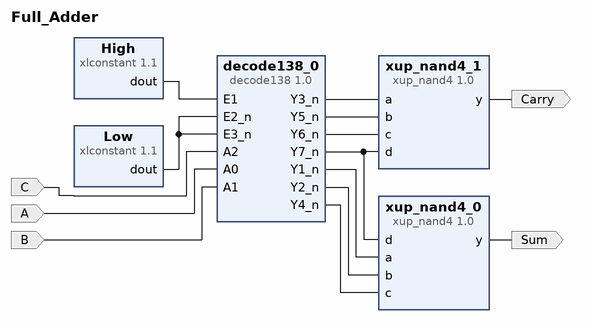
[diagram p0: block diagram of the top level]
# Vivado block design Full_Adder, xc7a35tcpg236-1, Vivado 2018.3
create_bd_design Full_Adder

create_bd_port -dir I C
create_bd_port -dir I A
create_bd_port -dir I B
create_bd_port -dir O Sum
create_bd_port -dir O Carry

create_bd_cell -type ip -vlnv xilinx.com:XUP:decode138:1.0 decode138_0
create_bd_cell -type ip -vlnv xilinx.com:ip:xlconstant:1.1 Low
set_property -dict {CONFIG.CONST_VAL 0} [get_bd_cells Low]
create_bd_cell -type ip -vlnv xilinx.com:ip:xlconstant:1.1 High
create_bd_cell -type ip -vlnv xilinx.com:xup:xup_nand4:1.0 xup_nand4_0
create_bd_cell -type ip -vlnv xilinx.com:xup:xup_nand4:1.0 xup_nand4_1

# ---- connections ----

connect_bd_net -net xlconstant_1_dout [get_bd_pins High/dout] [get_bd_pins decode138_0/E1]
connect_bd_net -net xlconstant_0_dout [get_bd_pins Low/dout] [get_bd_pins decode138_0/E2_n] [get_bd_pins decode138_0/E3_n]
connect_bd_net -net A2_0_1 [get_bd_ports C] [get_bd_pins decode138_0/A2]
connect_bd_net -net A0_0_1 [get_bd_ports A] [get_bd_pins decode138_0/A0]
connect_bd_net -net A1_0_1 [get_bd_ports B] [get_bd_pins decode138_0/A1]
connect_bd_net [get_bd_pins decode138_0/Y3_n] [get_bd_pins xup_nand4_1/a]
connect_bd_net [get_bd_pins decode138_0/Y5_n] [get_bd_pins xup_nand4_1/b]
connect_bd_net [get_bd_pins decode138_0/Y6_n] [get_bd_pins xup_nand4_1/c]
connect_bd_net [get_bd_pins decode138_0/Y7_n] [get_bd_pins xup_nand4_1/d] [get_bd_pins xup_nand4_0/d]
connect_bd_net [get_bd_pins decode138_0/Y1_n] [get_bd_pins xup_nand4_0/a]
connect_bd_net [get_bd_pins decode138_0/Y2_n] [get_bd_pins xup_nand4_0/b]
connect_bd_net [get_bd_pins decode138_0/Y4_n] [get_bd_pins xup_nand4_0/c]
connect_bd_net [get_bd_pins xup_nand4_0/y] [get_bd_ports Sum]
connect_bd_net [get_bd_pins xup_nand4_1/y] [get_bd_ports Carry]

validate_bd_design
save_bd_design
